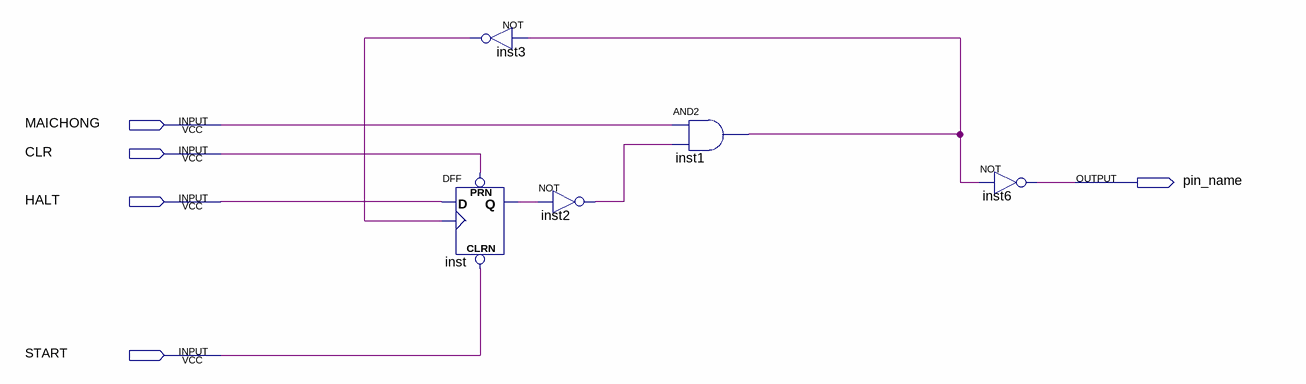
[diagram p0: schematic sheet]
// Quartus schematic HALT.bdf as structural Verilog: 5 symbols, 5 pins
module HALT (
  input  MAICHONG,
  input  CLR,
  input  HALT,
  input  START,
  output pin_name
);

  wire inst1_out, inst2_out, inst3_out, inst_q;

  DFF inst (.CLRN(START), .CLK(inst3_out), .D(HALT), .PRN(CLR), .Q(inst_q));
  not inst3 (inst3_out, inst1_out);
  not inst2 (inst2_out, inst_q);
  and inst1 (inst1_out, MAICHONG, inst2_out);
  not inst6 (pin_name, inst1_out);
endmodule
